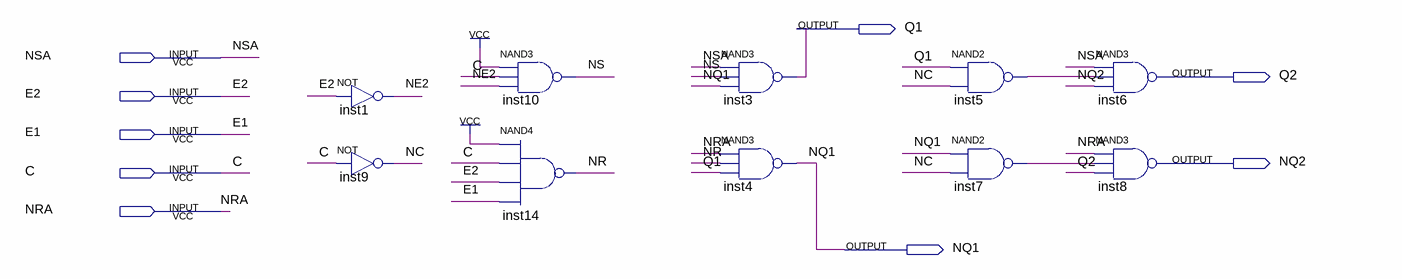
[diagram p0: schematic sheet]
// Quartus schematic primitives_scheme.bdf as structural Verilog: 10 symbols, 9 pins
module primitives_scheme (
  input  NSA,
  input  E2,
  input  E1,
  input  C,
  input  NRA,
  output Q1,
  output Q2,
  output NQ2,
  output NQ1
);

  wire inst5_out, inst7_out, NC, NE2, NR, NS;

  not inst1 (NE2, E2);
  not inst9 (NC, C);
  nand inst10 (NS, 1'b1, C, NE2);
  nand inst14 (NR, 1'b1, C, E2, E1);
  nand inst3 (Q1, NSA, NS, NQ1);
  nand inst4 (NQ1, NRA, NR, Q1);
  nand inst5 (inst5_out, Q1, NC);
  nand inst7 (inst7_out, NQ1, NC);
  nand inst6 (Q2, NSA, inst5_out, NQ2);
  nand inst8 (NQ2, NRA, inst7_out, Q2);
endmodule
